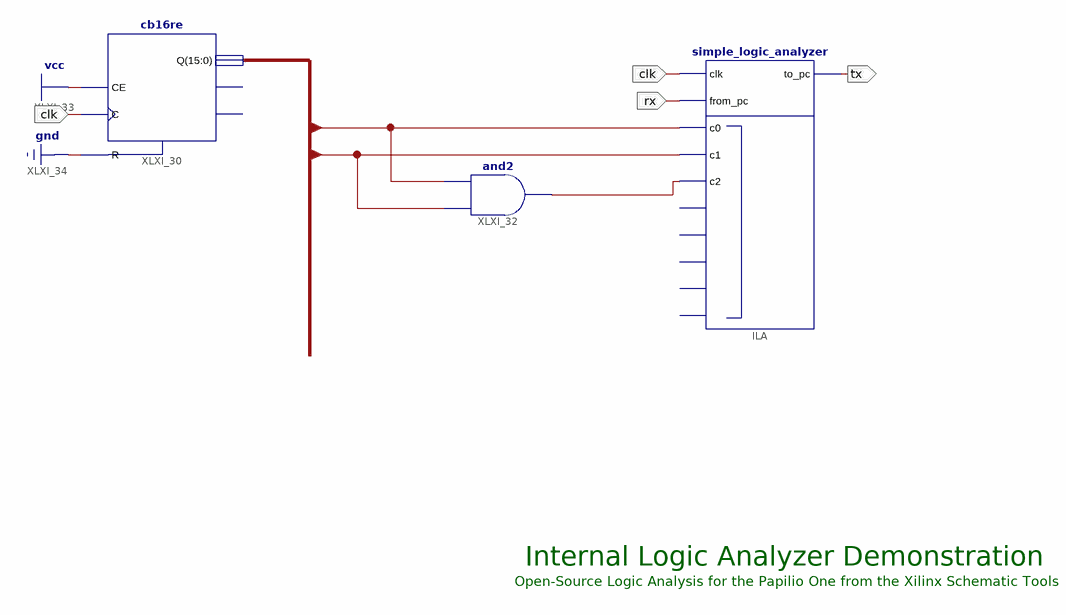
[diagram p0: schematic sheet 1]
// Xilinx ISE schematic papilio_one_example.sch (spartan3e) as structural Verilog: 3 symbols, 3 ports
module papilio_one_example (
  input  rx,
  input  clk,
  output tx
);

  wire XLXN_75;
  wire [15:0] COUNT;

  cb16re XLXI_30 (.C(clk), .CE(1'b1), .R(1'b0), .Q(COUNT));  // open: CEO, TC
  simple_logic_analyzer ILA (
    .clk(clk), .from_pc(rx), .to_pc(tx), .c0(COUNT[5]), .c2(XLXN_75), .c1(COUNT[7]));  // open: c7, c6, c5, c4, c3
  and XLXI_32 (XLXN_75, COUNT[7], COUNT[5]);

  // Notes on the sheet:
  //   Internal Logic Analyzer Demonstration
  //   Open-Source Logic Analysis for the Papilio One from the Xilinx Schematic Tools
endmodule
